# Altium schematic sheet Bank0-13-33.SchDoc: 02290_Sonoma_Controller
size B; ApprovedBy: J Johnson; CheckedBy: J Johnson; Author: sdfasdfdfAEFfasdFfaF; DrawnBy: J Johnson; Organization: Opsero Electronic Design; Address1: 21-915 Av. Marguerite-Bourgeoys; Address2: Québec (QC); Address3: G1S 3X4; DocumentNumber: OP009-001-SCH; Revision: D-1; SheetNumber: 07; SheetTotal: 16; Tel1: (581) 308-8830; Tel2: (581) 308-8830; Project: 02290_Sonoma_Controller; CheckedDate: 2013-12-13; Sheet: Bank0, Bank13 & Bank33; PageSetup: Record=PageOptions|CenterHorizontal=True|CenterVertical=True|PrintScale=1.08|XCorrection=1.00|YCorrection=1.00|PrintKind=0|BorderSize=5000000|LeftOffset=0|BottomOffset=0|Orientation=2|PaperLength=1000|PaperWidth=1000|Scale=100|PaperSource=7|PrintQuality=-4|MediaType=1|DitherType=10|PaperKind=Tabloid     [11 x 17 in]|PrintScaleMode=1; DrawDate: 2013-12-13; SchTitle: 02290_Sonoma_Controller; RevDescription: Replaced Q2,Q3 with STD16NF06LT4; RevDate: 2020-07-07; RevBy: J Johnson; RevDescription2: Added resistors to QSPI interface; ModifiedDate: 2020-07-07
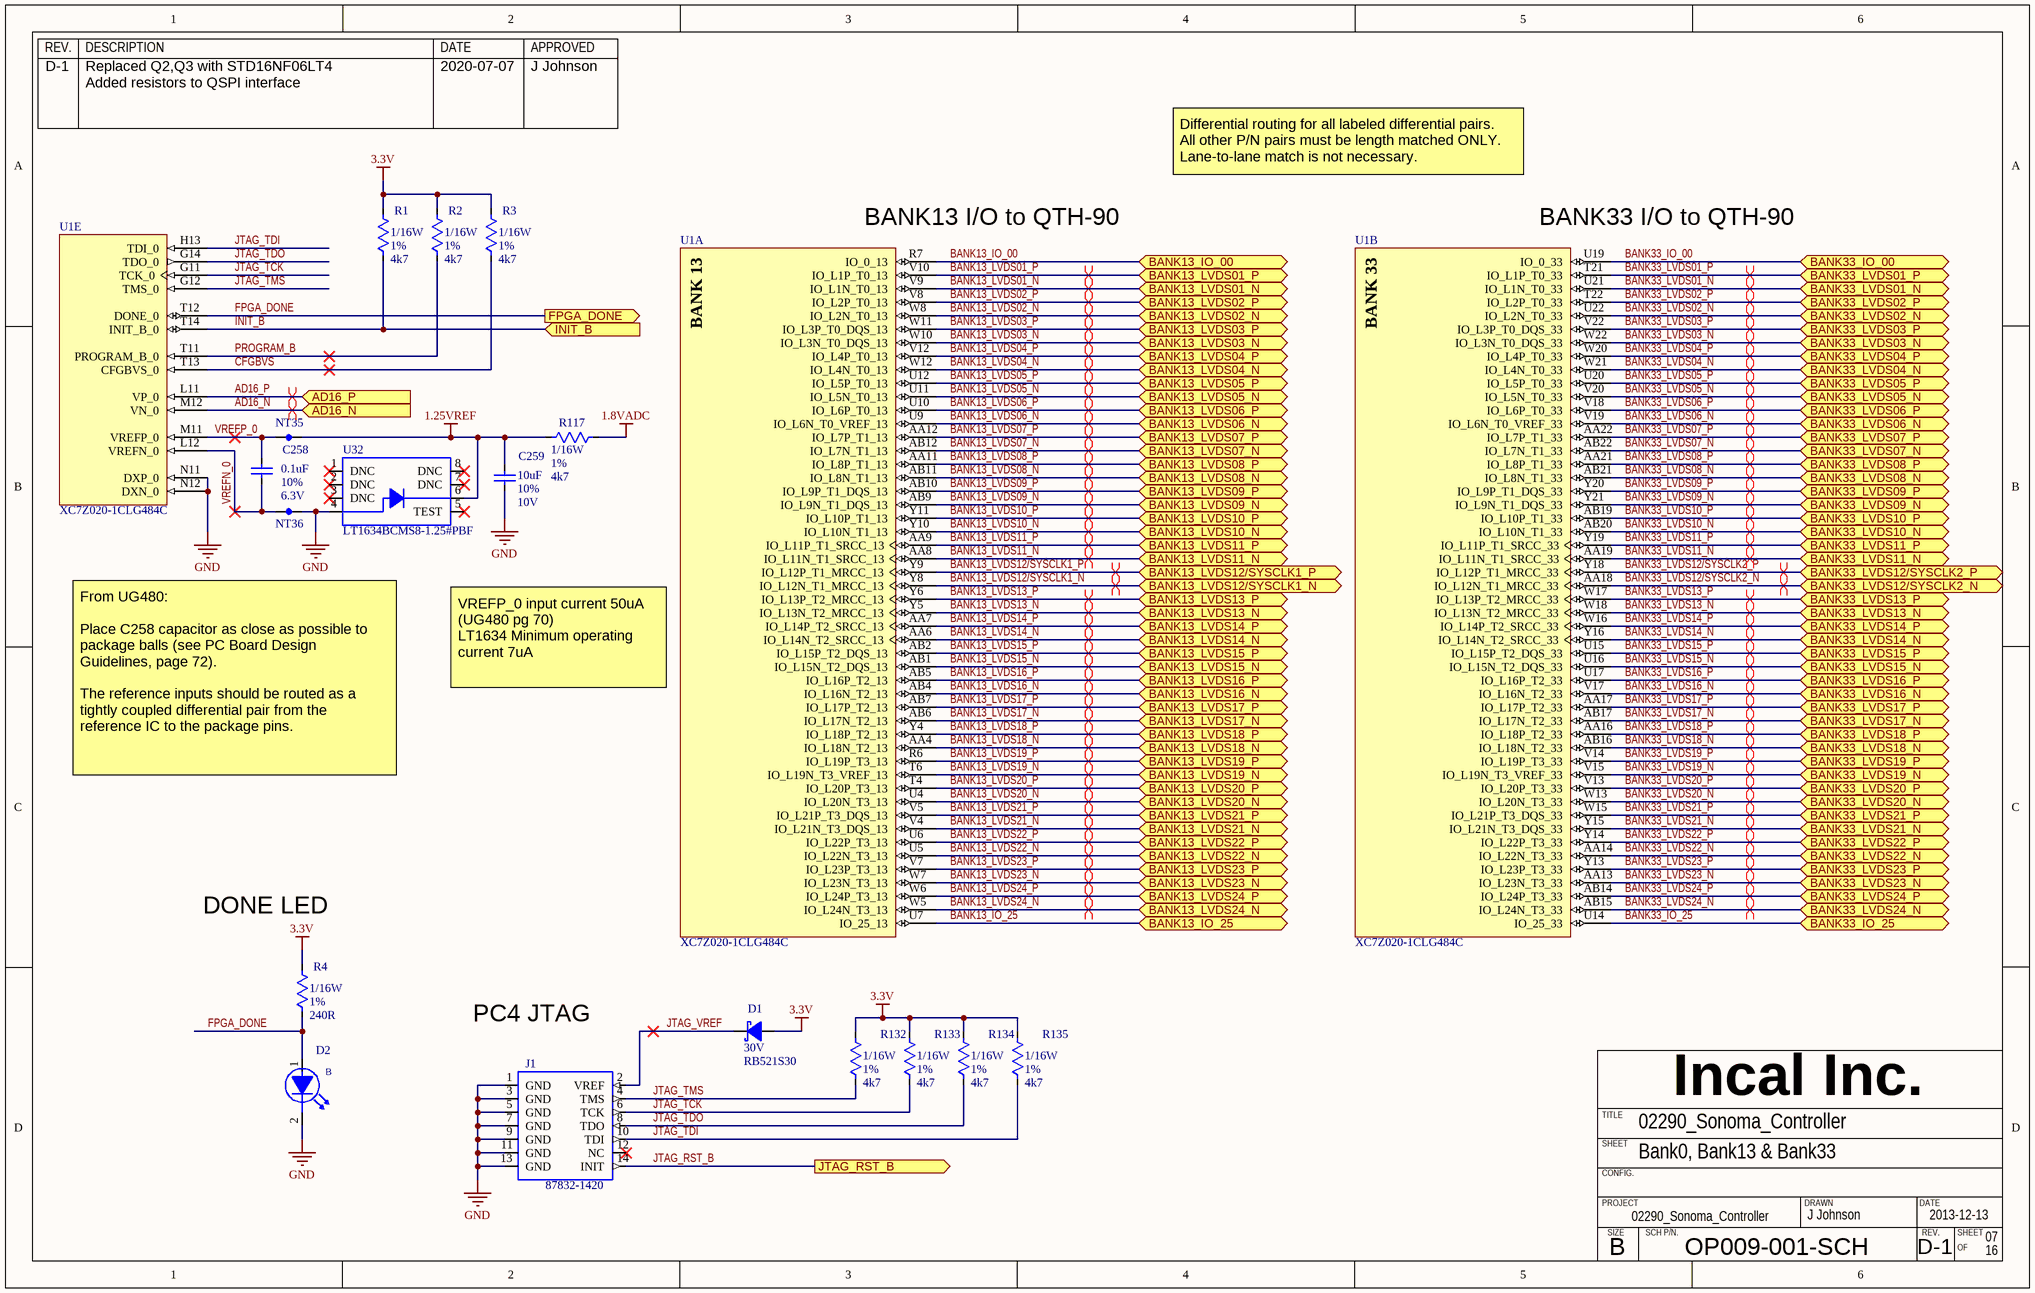
[diagram p0: Bank0-13-33.SchDoc]

## Parts
C258  value 0.1uF  Tolerance: 10%  Voltage: 6.3V  [CAPC0603X33N]  (hidden comment: CAPACITOR_NP_TYPE1)
C259  value 10uF  Tolerance: 10%  Voltage: 10V  [CAPC1608X38N]  (hidden comment: CAPACITOR_NP_TYPE1)
D1  value RB521S30  Voltage: 30V  [SOD15080X70]  (hidden comment: DIODE_SCHOTTKY_TYPE1)
D2  LED_BLU  [LEDM1608X38N-BLU]  (value not drawn)
J1  XILINX-JTAG-2x7  [87832-1420]  (value not drawn)
NT35  NET_TIE_1X1  [NET_TIE_1X1]  (value not drawn)  (net tie, no BOM)
NT36  NET_TIE_1X1  [NET_TIE_1X1]  (value not drawn)  (net tie, no BOM)
R1  value 4k7  Power: 1/16W  Tolerance: 1%  [RESC1005X33N]  (hidden comment: *)
R2  value 4k7  Power: 1/16W  Tolerance: 1%  [RESC1005X33N]  (hidden comment: *)
R3  value 4k7  Power: 1/16W  Tolerance: 1%  [RESC1005X33N]  (hidden comment: *)
R4  value 240R  Power: 1/16W  Tolerance: 1%  [RESC1005X33N]  (hidden comment: *)
R117  value 4k7  Power: 1/16W  Tolerance: 1%  [RESC1005X33N]  (hidden comment: *)
R132  value 4k7  Power: 1/16W  Tolerance: 1%  [RESC1005X33N]  (hidden comment: *)
R133  value 4k7  Power: 1/16W  Tolerance: 1%  [RESC1005X33N]  (hidden comment: *)
R134  value 4k7  Power: 1/16W  Tolerance: 1%  [RESC1005X33N]  (hidden comment: *)
R135  value 4k7  Power: 1/16W  Tolerance: 1%  [RESC1005X33N]  (hidden comment: *)
U1  XC7Z020-1CLG484C  [CLG484]  (parts A,B,E of 10)
U32  Mfg Part Number 1: LT1634BCMS8-1.25#PBF  [SOP65P490X110-8N]  (hidden comment: LT1634)

## Ports
AD16_N (in), AD16_P (in), BANK13_IO_00 (bidir), BANK13_IO_25 (bidir), BANK13_LVDS01_N (bidir), BANK13_LVDS01_P (bidir), BANK13_LVDS02_N (bidir), BANK13_LVDS02_P (bidir), BANK13_LVDS03_N (bidir), BANK13_LVDS03_P (bidir), BANK13_LVDS04_N (bidir), BANK13_LVDS04_P (bidir), BANK13_LVDS05_N (bidir), BANK13_LVDS05_P (bidir), BANK13_LVDS06_N (bidir), BANK13_LVDS06_P (bidir), BANK13_LVDS07_N (bidir), BANK13_LVDS07_P (bidir), BANK13_LVDS08_N (bidir), BANK13_LVDS08_P (bidir), BANK13_LVDS09_N (bidir), BANK13_LVDS09_P (bidir), BANK13_LVDS10_N (bidir), BANK13_LVDS10_P (bidir), BANK13_LVDS11_N (bidir), BANK13_LVDS11_P (bidir), BANK13_LVDS12/SYSCLK1_N (bidir), BANK13_LVDS12/SYSCLK1_P (bidir), BANK13_LVDS13_N (bidir), BANK13_LVDS13_P (bidir), BANK13_LVDS14_N (bidir), BANK13_LVDS14_P (bidir), BANK13_LVDS15_N (bidir), BANK13_LVDS15_P (bidir), BANK13_LVDS16_N (bidir), BANK13_LVDS16_P (bidir), BANK13_LVDS17_N (bidir), BANK13_LVDS17_P (bidir), BANK13_LVDS18_N (bidir), BANK13_LVDS18_P (bidir), BANK13_LVDS19_N (bidir), BANK13_LVDS19_P (bidir), BANK13_LVDS20_N (bidir), BANK13_LVDS20_P (bidir), BANK13_LVDS21_N (bidir), BANK13_LVDS21_P (bidir), BANK13_LVDS22_N (bidir), BANK13_LVDS22_P (bidir), BANK13_LVDS23_N (bidir), BANK13_LVDS23_P (bidir), BANK13_LVDS24_N (bidir), BANK13_LVDS24_P (bidir), BANK33_IO_00 (bidir), BANK33_IO_25 (bidir), BANK33_LVDS01_N (bidir), BANK33_LVDS01_P (bidir), BANK33_LVDS02_N (bidir), BANK33_LVDS02_P (bidir), BANK33_LVDS03_N (bidir), BANK33_LVDS03_P (bidir), BANK33_LVDS04_N (bidir), BANK33_LVDS04_P (bidir), BANK33_LVDS05_N (bidir), BANK33_LVDS05_P (bidir), BANK33_LVDS06_N (bidir), BANK33_LVDS06_P (bidir), BANK33_LVDS07_N (bidir), BANK33_LVDS07_P (bidir), BANK33_LVDS08_N (bidir), BANK33_LVDS08_P (bidir), BANK33_LVDS09_N (bidir), BANK33_LVDS09_P (bidir), BANK33_LVDS10_N (bidir), BANK33_LVDS10_P (bidir), BANK33_LVDS11_N (bidir), BANK33_LVDS11_P (bidir), BANK33_LVDS12/SYSCLK2_N (bidir), BANK33_LVDS12/SYSCLK2_P (bidir), BANK33_LVDS13_N (bidir), BANK33_LVDS13_P (bidir), BANK33_LVDS14_N (bidir), BANK33_LVDS14_P (bidir), BANK33_LVDS15_N (bidir), BANK33_LVDS15_P (bidir), BANK33_LVDS16_N (bidir), BANK33_LVDS16_P (bidir), BANK33_LVDS17_N (bidir), BANK33_LVDS17_P (bidir), BANK33_LVDS18_N (bidir), BANK33_LVDS18_P (bidir), BANK33_LVDS19_N (bidir), BANK33_LVDS19_P (bidir), BANK33_LVDS20_N (bidir), BANK33_LVDS20_P (bidir), BANK33_LVDS21_N (bidir), BANK33_LVDS21_P (bidir), BANK33_LVDS22_N (bidir), BANK33_LVDS22_P (bidir), BANK33_LVDS23_N (bidir), BANK33_LVDS23_P (bidir), BANK33_LVDS24_N (bidir), BANK33_LVDS24_P (bidir), FPGA_DONE (out), INIT_B (in), JTAG_RST_B (out)

## Nets
1.8VADC: R117.2
1.25VREF: C259.1 NT35.2 R117.1 U32.6(VOUT)
3.3V: D1.1(A) R1.2 R2.2 R3.2 R4.2 R132.2 R133.2 R134.2 R135.2
GND: C259.2 D2.2(K) J1.1(GND) J1.3(GND) J1.5(GND) J1.7(GND) J1.9(GND) J1.11(GND) J1.13(GND) NT36.2 U1.N11(DXP_0) U1.N12(DXN_0) U32.4(GND)
AD16_N: U1.M12(VN_0) ; port AD16_N
AD16_P: U1.L11(VP_0) ; port AD16_P
BANK13_IO_00: U1.R7(IO_0_13) ; port BANK13_IO_00
BANK13_IO_25: U1.U7(IO_25_13) ; port BANK13_IO_25
BANK13_LVDS01_N: U1.V9(IO_L1N_T0_13) ; port BANK13_LVDS01_N
BANK13_LVDS01_P: U1.V10(IO_L1P_T0_13) ; port BANK13_LVDS01_P
BANK13_LVDS02_N: U1.W8(IO_L2N_T0_13) ; port BANK13_LVDS02_N
BANK13_LVDS02_P: U1.V8(IO_L2P_T0_13) ; port BANK13_LVDS02_P
BANK13_LVDS03_N: U1.W10(IO_L3N_T0_DQS_13) ; port BANK13_LVDS03_N
BANK13_LVDS03_P: U1.W11(IO_L3P_T0_DQS_13) ; port BANK13_LVDS03_P
BANK13_LVDS04_N: U1.W12(IO_L4N_T0_13) ; port BANK13_LVDS04_N
BANK13_LVDS04_P: U1.V12(IO_L4P_T0_13) ; port BANK13_LVDS04_P
BANK13_LVDS05_N: U1.U11(IO_L5N_T0_13) ; port BANK13_LVDS05_N
BANK13_LVDS05_P: U1.U12(IO_L5P_T0_13) ; port BANK13_LVDS05_P
BANK13_LVDS06_N: U1.U9(IO_L6N_T0_VREF_13) ; port BANK13_LVDS06_N
BANK13_LVDS06_P: U1.U10(IO_L6P_T0_13) ; port BANK13_LVDS06_P
BANK13_LVDS07_N: U1.AB12(IO_L7N_T1_13) ; port BANK13_LVDS07_N
BANK13_LVDS07_P: U1.AA12(IO_L7P_T1_13) ; port BANK13_LVDS07_P
BANK13_LVDS08_N: U1.AB11(IO_L8N_T1_13) ; port BANK13_LVDS08_N
BANK13_LVDS08_P: U1.AA11(IO_L8P_T1_13) ; port BANK13_LVDS08_P
BANK13_LVDS09_N: U1.AB9(IO_L9N_T1_DQS_13) ; port BANK13_LVDS09_N
BANK13_LVDS09_P: U1.AB10(IO_L9P_T1_DQS_13) ; port BANK13_LVDS09_P
BANK13_LVDS10_N: U1.Y10(IO_L10N_T1_13) ; port BANK13_LVDS10_N
BANK13_LVDS10_P: U1.Y11(IO_L10P_T1_13) ; port BANK13_LVDS10_P
BANK13_LVDS11_N: U1.AA8(IO_L11N_T1_SRCC_13) ; port BANK13_LVDS11_N
BANK13_LVDS11_P: U1.AA9(IO_L11P_T1_SRCC_13) ; port BANK13_LVDS11_P
BANK13_LVDS12/SYSCLK1_N: U1.Y8(IO_L12N_T1_MRCC_13) ; port BANK13_LVDS12/SYSCLK1_N
BANK13_LVDS12/SYSCLK1_P: U1.Y9(IO_L12P_T1_MRCC_13) ; port BANK13_LVDS12/SYSCLK1_P
BANK13_LVDS13_N: U1.Y5(IO_L13N_T2_MRCC_13) ; port BANK13_LVDS13_N
BANK13_LVDS13_P: U1.Y6(IO_L13P_T2_MRCC_13) ; port BANK13_LVDS13_P
BANK13_LVDS14_N: U1.AA6(IO_L14N_T2_SRCC_13) ; port BANK13_LVDS14_N
BANK13_LVDS14_P: U1.AA7(IO_L14P_T2_SRCC_13) ; port BANK13_LVDS14_P
BANK13_LVDS15_N: U1.AB1(IO_L15N_T2_DQS_13) ; port BANK13_LVDS15_N
BANK13_LVDS15_P: U1.AB2(IO_L15P_T2_DQS_13) ; port BANK13_LVDS15_P
BANK13_LVDS16_N: U1.AB4(IO_L16N_T2_13) ; port BANK13_LVDS16_N
BANK13_LVDS16_P: U1.AB5(IO_L16P_T2_13) ; port BANK13_LVDS16_P
BANK13_LVDS17_N: U1.AB6(IO_L17N_T2_13) ; port BANK13_LVDS17_N
BANK13_LVDS17_P: U1.AB7(IO_L17P_T2_13) ; port BANK13_LVDS17_P
BANK13_LVDS18_N: U1.AA4(IO_L18N_T2_13) ; port BANK13_LVDS18_N
BANK13_LVDS18_P: U1.Y4(IO_L18P_T2_13) ; port BANK13_LVDS18_P
BANK13_LVDS19_N: U1.T6(IO_L19N_T3_VREF_13) ; port BANK13_LVDS19_N
BANK13_LVDS19_P: U1.R6(IO_L19P_T3_13) ; port BANK13_LVDS19_P
BANK13_LVDS20_N: U1.U4(IO_L20N_T3_13) ; port BANK13_LVDS20_N
BANK13_LVDS20_P: U1.T4(IO_L20P_T3_13) ; port BANK13_LVDS20_P
BANK13_LVDS21_N: U1.V4(IO_L21N_T3_DQS_13) ; port BANK13_LVDS21_N
BANK13_LVDS21_P: U1.V5(IO_L21P_T3_DQS_13) ; port BANK13_LVDS21_P
BANK13_LVDS22_N: U1.U5(IO_L22N_T3_13) ; port BANK13_LVDS22_N
BANK13_LVDS22_P: U1.U6(IO_L22P_T3_13) ; port BANK13_LVDS22_P
BANK13_LVDS23_N: U1.W7(IO_L23N_T3_13) ; port BANK13_LVDS23_N
BANK13_LVDS23_P: U1.V7(IO_L23P_T3_13) ; port BANK13_LVDS23_P
BANK13_LVDS24_N: U1.W5(IO_L24N_T3_13) ; port BANK13_LVDS24_N
BANK13_LVDS24_P: U1.W6(IO_L24P_T3_13) ; port BANK13_LVDS24_P
BANK33_IO_00: U1.U19(IO_0_33) ; port BANK33_IO_00
BANK33_IO_25: U1.U14(IO_25_33) ; port BANK33_IO_25
BANK33_LVDS01_N: U1.U21(IO_L1N_T0_33) ; port BANK33_LVDS01_N
BANK33_LVDS01_P: U1.T21(IO_L1P_T0_33) ; port BANK33_LVDS01_P
BANK33_LVDS02_N: U1.U22(IO_L2N_T0_33) ; port BANK33_LVDS02_N
BANK33_LVDS02_P: U1.T22(IO_L2P_T0_33) ; port BANK33_LVDS02_P
BANK33_LVDS03_N: U1.W22(IO_L3N_T0_DQS_33) ; port BANK33_LVDS03_N
BANK33_LVDS03_P: U1.V22(IO_L3P_T0_DQS_33) ; port BANK33_LVDS03_P
BANK33_LVDS04_N: U1.W21(IO_L4N_T0_33) ; port BANK33_LVDS04_N
BANK33_LVDS04_P: U1.W20(IO_L4P_T0_33) ; port BANK33_LVDS04_P
BANK33_LVDS05_N: U1.V20(IO_L5N_T0_33) ; port BANK33_LVDS05_N
BANK33_LVDS05_P: U1.U20(IO_L5P_T0_33) ; port BANK33_LVDS05_P
BANK33_LVDS06_N: U1.V19(IO_L6N_T0_VREF_33) ; port BANK33_LVDS06_N
BANK33_LVDS06_P: U1.V18(IO_L6P_T0_33) ; port BANK33_LVDS06_P
BANK33_LVDS07_N: U1.AB22(IO_L7N_T1_33) ; port BANK33_LVDS07_N
BANK33_LVDS07_P: U1.AA22(IO_L7P_T1_33) ; port BANK33_LVDS07_P
BANK33_LVDS08_N: U1.AB21(IO_L8N_T1_33) ; port BANK33_LVDS08_N
BANK33_LVDS08_P: U1.AA21(IO_L8P_T1_33) ; port BANK33_LVDS08_P
BANK33_LVDS09_N: U1.Y21(IO_L9N_T1_DQS_33) ; port BANK33_LVDS09_N
BANK33_LVDS09_P: U1.Y20(IO_L9P_T1_DQS_33) ; port BANK33_LVDS09_P
BANK33_LVDS10_N: U1.AB20(IO_L10N_T1_33) ; port BANK33_LVDS10_N
BANK33_LVDS10_P: U1.AB19(IO_L10P_T1_33) ; port BANK33_LVDS10_P
BANK33_LVDS11_N: U1.AA19(IO_L11N_T1_SRCC_33) ; port BANK33_LVDS11_N
BANK33_LVDS11_P: U1.Y19(IO_L11P_T1_SRCC_33) ; port BANK33_LVDS11_P
BANK33_LVDS12/SYSCLK2_N: U1.AA18(IO_L12N_T1_MRCC_33) ; port BANK33_LVDS12/SYSCLK2_N
BANK33_LVDS12/SYSCLK2_P: U1.Y18(IO_L12P_T1_MRCC_33) ; port BANK33_LVDS12/SYSCLK2_P
BANK33_LVDS13_N: U1.W18(IO_L13N_T2_MRCC_33) ; port BANK33_LVDS13_N
BANK33_LVDS13_P: U1.W17(IO_L13P_T2_MRCC_33) ; port BANK33_LVDS13_P
BANK33_LVDS14_N: U1.Y16(IO_L14N_T2_SRCC_33) ; port BANK33_LVDS14_N
BANK33_LVDS14_P: U1.W16(IO_L14P_T2_SRCC_33) ; port BANK33_LVDS14_P
BANK33_LVDS15_N: U1.U16(IO_L15N_T2_DQS_33) ; port BANK33_LVDS15_N
BANK33_LVDS15_P: U1.U15(IO_L15P_T2_DQS_33) ; port BANK33_LVDS15_P
BANK33_LVDS16_N: U1.V17(IO_L16N_T2_33) ; port BANK33_LVDS16_N
BANK33_LVDS16_P: U1.U17(IO_L16P_T2_33) ; port BANK33_LVDS16_P
BANK33_LVDS17_N: U1.AB17(IO_L17N_T2_33) ; port BANK33_LVDS17_N
BANK33_LVDS17_P: U1.AA17(IO_L17P_T2_33) ; port BANK33_LVDS17_P
BANK33_LVDS18_N: U1.AB16(IO_L18N_T2_33) ; port BANK33_LVDS18_N
BANK33_LVDS18_P: U1.AA16(IO_L18P_T2_33) ; port BANK33_LVDS18_P
BANK33_LVDS19_N: U1.V15(IO_L19N_T3_VREF_33) ; port BANK33_LVDS19_N
BANK33_LVDS19_P: U1.V14(IO_L19P_T3_33) ; port BANK33_LVDS19_P
BANK33_LVDS20_N: U1.W13(IO_L20N_T3_33) ; port BANK33_LVDS20_N
BANK33_LVDS20_P: U1.V13(IO_L20P_T3_33) ; port BANK33_LVDS20_P
BANK33_LVDS21_N: U1.Y15(IO_L21N_T3_DQS_33) ; port BANK33_LVDS21_N
BANK33_LVDS21_P: U1.W15(IO_L21P_T3_DQS_33) ; port BANK33_LVDS21_P
BANK33_LVDS22_N: U1.AA14(IO_L22N_T3_33) ; port BANK33_LVDS22_N
BANK33_LVDS22_P: U1.Y14(IO_L22P_T3_33) ; port BANK33_LVDS22_P
BANK33_LVDS23_N: U1.AA13(IO_L23N_T3_33) ; port BANK33_LVDS23_N
BANK33_LVDS23_P: U1.Y13(IO_L23P_T3_33) ; port BANK33_LVDS23_P
BANK33_LVDS24_N: U1.AB15(IO_L24N_T3_33) ; port BANK33_LVDS24_N
BANK33_LVDS24_P: U1.AB14(IO_L24P_T3_33) ; port BANK33_LVDS24_P
CFGBVS: R3.1 U1.T13(CFGBVS_0)
FPGA_DONE: D2.1(A) R4.1 U1.T12(DONE_0) ; port FPGA_DONE
INIT_B: R1.1 U1.T14(INIT_B_0) ; port INIT_B
JTAG_RST_B: J1.14(INIT) ; port JTAG_RST_B
JTAG_TCK: J1.6(TCK) R133.1 U1.G11(TCK_0)
JTAG_TDI: J1.10(TDI) R135.1 U1.H13(TDI_0)
JTAG_TDO: J1.8(TDO) R134.1 U1.G14(TDO_0)
JTAG_TMS: J1.4(TMS) R132.1 U1.G12(TMS_0)
JTAG_VREF: D1.2(K) J1.2(VREF)
PROGRAM_B: R2.1 U1.T11(PROGRAM_B_0)
VREFN_0: C258.2 NT36.1 U1.L12(VREFN_0)
VREFP_0: C258.1 NT35.1 U1.M11(VREFP_0)

Not connected (* = marked no-connect by the designer): J1 12(NC)*; U32 1(DNC)* 2(DNC)* 3(DNC)* 5(TEST)* 7(DNC)* 8(DNC)*

## Layout directives
differential pair: AD16_N, AD16_P, BANK13_LVDS01_N, BANK13_LVDS01_P, BANK13_LVDS02_N, BANK13_LVDS02_P, BANK13_LVDS03_N, BANK13_LVDS03_P, BANK13_LVDS04_N, BANK13_LVDS04_P, BANK13_LVDS05_N, BANK13_LVDS05_P, BANK13_LVDS06_N, BANK13_LVDS06_P, BANK13_LVDS07_N, BANK13_LVDS07_P, BANK13_LVDS08_N, BANK13_LVDS08_P, BANK13_LVDS09_N, BANK13_LVDS09_P, BANK13_LVDS10_N, BANK13_LVDS10_P, BANK13_LVDS11_N, BANK13_LVDS11_P, BANK13_LVDS12/SYSCLK1_N, BANK13_LVDS12/SYSCLK1_P, BANK13_LVDS13_N, BANK13_LVDS13_P, BANK13_LVDS14_N, BANK13_LVDS14_P, BANK13_LVDS15_N, BANK13_LVDS15_P, BANK13_LVDS16_N, BANK13_LVDS16_P, BANK13_LVDS17_N, BANK13_LVDS17_P, BANK13_LVDS18_N, BANK13_LVDS18_P, BANK13_LVDS19_N, BANK13_LVDS19_P, BANK13_LVDS20_N, BANK13_LVDS20_P, BANK13_LVDS21_N, BANK13_LVDS21_P, BANK13_LVDS22_N, BANK13_LVDS22_P, BANK13_LVDS23_N, BANK13_LVDS23_P, BANK13_LVDS24_N, BANK13_LVDS24_P, BANK33_LVDS01_N, BANK33_LVDS01_P, BANK33_LVDS02_N, BANK33_LVDS02_P, BANK33_LVDS03_N, BANK33_LVDS03_P, BANK33_LVDS04_N, BANK33_LVDS04_P, BANK33_LVDS05_N, BANK33_LVDS05_P, BANK33_LVDS06_N, BANK33_LVDS06_P, BANK33_LVDS07_N, BANK33_LVDS07_P, BANK33_LVDS08_N, BANK33_LVDS08_P, BANK33_LVDS09_N, BANK33_LVDS09_P, BANK33_LVDS10_N, BANK33_LVDS10_P, BANK33_LVDS11_N, BANK33_LVDS11_P, BANK33_LVDS12/SYSCLK2_N, BANK33_LVDS12/SYSCLK2_P, BANK33_LVDS13_N, BANK33_LVDS13_P, BANK33_LVDS14_N, BANK33_LVDS14_P, BANK33_LVDS15_N, BANK33_LVDS15_P, BANK33_LVDS16_N, BANK33_LVDS16_P, BANK33_LVDS17_N, BANK33_LVDS17_P, BANK33_LVDS18_N, BANK33_LVDS18_P, BANK33_LVDS19_N, BANK33_LVDS19_P, BANK33_LVDS20_N, BANK33_LVDS20_P, BANK33_LVDS21_N, BANK33_LVDS21_P, BANK33_LVDS22_N, BANK33_LVDS22_P, BANK33_LVDS23_N, BANK33_LVDS23_P, BANK33_LVDS24_N, BANK33_LVDS24_P

## Notes on the sheet
- (near U1) BANK13 I/O to QTH-90
- Differential routing for all labeled differential pairs.
  All other P/N pairs must be length matched ONLY.
  Lane-to-lane match is not necessary.
- (near U1) BANK33 I/O to QTH-90
- VREFP_0 input current 50uA (UG480 pg 70)
  LT1634 Minimum operating current 7uA
- From UG480:
  Place C258 capacitor as close as possible to package balls (see PC Board Design Guidelines, page 72).
  The reference inputs should be routed as a tightly coupled differential pair from the
  reference IC to the package pins.
- (near R4) DONE LED
- PC4 JTAG
- REV.
- DESCRIPTION
- DATE
- APPROVED
- Incal Inc.
- SHEET
- TITLE
- CONFIG.
- PROJECT
- SIZE
- SCH P/N.
- DRAWN
- B
- OF
- (in symbol LTST-C191TBKT) B
- (in symbol XC7Z020-1CLG484C, part A) BANK 13
- (in symbol XC7Z020-1CLG484C, part B) BANK 33

## Library data of the parts
C258 = C0201_0.1uF_10%_6.3V_X5R: Capacitor ceramic, X5R, 0.1uF, 6.3V, 10%, -55 to +125 C, EIA0201; Manufacturer 1: Murata; Mfg Part Number 1: GRM033R60J104KE19D; EIA(I) Package: 0201; EIA(M) Package: 0603; ASSY: USED; Status: Active; Power: *; Current: *; Part Ref: C0201_0.1uF_10%_6.3V_X5R; Comment_1: *; RoHs: True; Operating Temp: -55 to +85 C
C259 = C0603_10uF_10%_10V_X5R: Capacitor ceramic, X5R, 10uF, 10V, 10%, -55 to +85 C, EIA0603; Manufacturer 1: TDK Corporation; Mfg Part Number 1: C1608X5R1A106K080AC; EIA(I) Package: 0603; EIA(M) Package: 1608; ASSY: USED; Status: Active; Power: *; Current: *; Part Ref: C0603_10uF_10%_10V_X5R; Comment_1: *; RoHs: True; Operating Temp: -55 to +85 C
D1 = RB521S30: Diode schottky, 30V, 200mA, SOD-523F; Manufacturer 1: ON Semiconductor; Status: Active; Power: *; Current: 200mA; EIA(I) Package: *; EIA(M) Package: *; Part Ref: RB521S30; Tolerance: *; RoHs: True; Package: SOD-523F; Datasheet 1: https://www.onsemi.com/pub/Collateral/RB521S30-D.pdf; Mfg Part Number 1: RB521S30; Operating Temp: -55 to +125 C
D2 = LTST-C191TBKT: Led, Blue, 150mcd, SMT, LTST-C191TBKT, -20 to +80 C, 0603; Manufacturer 1: LITE-ON; EIA(I) Package: 0603; ASSY: USED; Power: 120mW; Current: 20mA; Voltage: 3.2V; Status: Active; EIA(M) Package: *; Part Ref: LTST-C191TBKT; Tolerance: *; Package: *; RoHs: True; Value: LTST-C191TBKT; Operating Temp: -20 to +80 C; Mfg Part Number 1: LTST-C191TBKT
J1 = JTAG_XILINX_SMT_2X7: Connector Header 2mm, 2x7, SMT, Keyed, Shrouded, 0V, 0A, -55 to +105 C; Manufacturer 1: Molex; ASSY: USED; Power: Pow; Comment_1: Com; Value: 87832-1420; Status: Active; EIA(I) Package: *; EIA(M) Package: *; Part Ref: JTAG_XILINX_SMT_2X7; Current: 0A; Tolerance: *; Voltage: 0V; Package: *; RoHs: True; Operating Temp: -55 to +105 C; Mfg Part Number 1: 87832-1420; Datasheet 1: ..\datasheet\Connector\Molex\Header\87831-1420\2012-10-25\
NT35 NT36 = NET_TIE_1X1: Net Tie 1 to 1; ASSY: USED; Status: Active; Power: *; Current: *; EIA(I) Package: *; EIA(M) Package: *; Part Ref: NET_TIE_1X1; Comment_1: *; RoHs: True; Value: NET_TIE; Tolerance: *; Voltage: *
R1-R3 R117 R132-R135 = R0402_4k70_1%: Resistor, 4k7, 1/16W, 1%, -55 to +155 C, EIA0402; Manufacturer 1: Yageo; Mfg Part Number 1: RC0402FR-074k7L; EIA(I) Package: 0402; EIA(M) Package: 1005; Voltage: 50V; ASSY: USED; Status: Active; Part Ref: R0402_4k70_1%; Current: *; Comment_1: *; RoHs: True; Operating Temp: -55 to +155 C; Datasheet 1: ..\datasheet\Resistor\Yaego\Thick_Film\RC0402\2012-03-29; Manufacturer 2: Vishay Dale; Mfg Part Number 2: CRCW04024k70FKED; Datasheet 2: ..\datasheet\Resistor\Vishay Dale\CRC\2012-03-29
R4 = R0402_240R_1%: Resistor, 240R, 1/16W, 1%, -50 to +155 C, EIA0402, EIA(M)1005; Manufacturer 1: Vishay Dale; Mfg Part Number 1: CRCW0402240RFKED; EIA(I) Package: 0402; EIA(M) Package: 1005; Voltage: 50V; ASSY: USED; Status: Active; Part Ref: R0402_240R_1%; Current: *; Comment_1: *; RoHs: True; Operating Temp: -50 to +155 C
U1 = XC7Z020-1CLG484C: 667 MHz Zynq™-7000 AP SoC, 130 PS I/O, 200 FPGA I/O, 484-Ball BGA, Speed Grade 1, Commercial Grade; Manufacturer: Xilinx; Extensible Block RAM (# 36Kb Blocks): 560 KB (140); Flip Flops: 106400; LUTs: 53200; Speed Grade: -1; DatasheetVersion: v1.2; PackageVersion: Rev 1.1; PackageReference: CLG484; PackageDescription: Wire-Bond Chip-Scale BGA, Body 19 x 19 mm, 0.8 mm Pitch; Generic Part Number: XC7Z020; RoHS: True; Mounting Technology: Surface Mount; Code_JEDEC: MO-275-PPAA-2; PartNumber: XC7Z020-1CLG484C; ComponentLink1Description: Datasheet; ComponentLink1URL: http://www.xilinx.com/support/documentation/data_sheets/ds190-Zynq-7000-Overview.pdf; ComponentLink2Description: Package Specification; ComponentLink2URL: http://www.xilinx.com/support/documentation/user_guides/ug865-Zynq-7000-Pkg-Pinout.pdf; ComponentLink3Description: DC and AC Switching Characteristics; ComponentLink3URL: http://www.xilinx.com/support/documentation/data_sheets/ds187-XC7Z010-XC7Z020-Data-Sheet.pdf; ComponentLink4Description: Package File; ComponentLink4URL: http://www.xilinx.com/support/packagefiles/z7packages/xc7z020clg484pkg.txt; ComponentLink5Description: Packaging and Pinout; ComponentLink5URL: http://www.xilinx.com/support/documentation/user_guides/ug865-Zynq-7000-Pkg-Pinout.pdf; ComponentLink6Description: PCB and Layout Guide; ComponentLink6URL: http://www.xilinx.com/support/documentation/user_guides/ug483_7Series_PCB.pdf; Part Ref: XC7Z020-1CLG484C; Status: Active; Value: XC7Z020-1CLG484C; Manufacturer 1: Xilinx; Mfg Part Number 1: XC7Z020-1CLG484C; Package: CLG484
U32 = LT1634BCMS8-1.25#PBF: Reference Shunt 1.25V, 10ppm, 0.05%; Manufacturer 1: Linear Technology; ASSY: USED; Power: Pow; Current: Cur; Voltage: Vol; Status: Active; EIA(I) Package: *; EIA(M) Package: *; Part Ref: LT1634BCMS8-1.25#PBF; Tolerance: ±0.05%; Package: SOT23-5; RoHs: True; Value: 1.25V; Operating Temp: 0 to +70 C